# Altium schematic sheet imu.SchDoc
size A
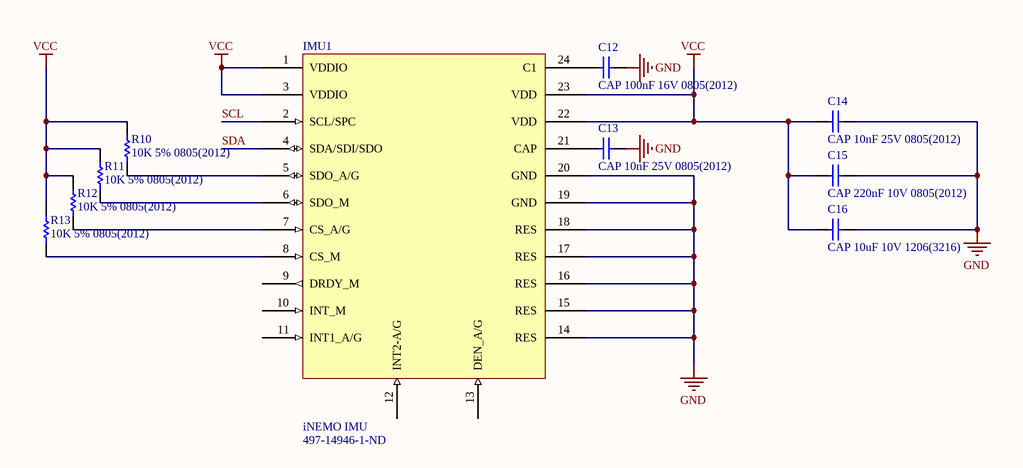
[diagram p0: imu.SchDoc]

## Parts
C12  CAP 100nF 16V 0805(2012)  [CAPC0805(2012)145_M]
C13  CAP 10nF 25V 0805(2012)  [CAPC0805(2012)100_L]
C14  CAP 10nF 25V 0805(2012)  [CAPC0805(2012)100_L]
C15  CAP 220nF 10V 0805(2012)  [CAPC0805(2012)75_N]
C16  CAP 10uF 10V 1206(3216)  [CAPC1206(3216)130_L]
IMU1  iNEMO IMU  Supplier Part Number 1: 497-14946-1-ND  [LGA-24]
R10  10K 5% 0805(2012)  [RESC0805(2012)_L]
R11  10K 5% 0805(2012)  [RESC0805(2012)_L]
R12  10K 5% 0805(2012)  [RESC0805(2012)_L]
R13  10K 5% 0805(2012)  [RESC0805(2012)_L]

## Nets
GND: C12.2 C13.2 C14.2 C15.1 C16.2 IMU1.14(RES) IMU1.15(RES) IMU1.16(RES) IMU1.17(RES) IMU1.18(RES) IMU1.19(GND) IMU1.20(GND)
VCC: C14.1 C15.2 C16.1 IMU1.1(VDDIO) IMU1.3(VDDIO) IMU1.22(VDD) IMU1.23(VDD) R10.2 R11.2 R12.2 R13.2
SCL: IMU1.2(SCL/SPC)
SDA: IMU1.4(SDA/SDI/SDO)
NetC12_1: C12.1 IMU1.24(C1)
NetC13_1: C13.1 IMU1.21(CAP)
NetIMU1_5: IMU1.5(SDO_A/G) R10.1
NetIMU1_6: IMU1.6(SDO_M) R11.1
NetIMU1_7: IMU1.7(CS_A/G) R12.1
NetIMU1_8: IMU1.8(CS_M) R13.1

Not connected (* = marked no-connect by the designer): IMU1 9(DRDY_M) 10(INT_M) 11(INT1_A/G) 12(INT2-A/G) 13(DEN_A/G)

## Library data of the parts
C12 = CMP-1036-04404-1: CAP 100nF 16V ±20% 0805 (2012 Metric) Thickness 1.45mm SMD; Case-Metric: 2012; Case-EIA: 0805; Tolerance: Â±20%; Rated Voltage: 16 V; Max Thickness: 1.45 mm; Value: 100nF; Technology: SMT
C13 C14 = CMP-1036-03826-1: CAP 10nF 25V ±2% 0805 (2012 Metric) Thickness 1mm SMD; Tolerance: Â±2%; Case-EIA: 0805; Case-Metric: 2012; Technology: SMT; Rated Voltage: 25 V; Value: 10nF; Max Thickness: 1 mm
C15 = CMP-1036-04526-1: CAP 220nF 10V ±20% 0805 (2012 Metric) Thickness 0.75mm SMD; Tolerance: Â±20%; Case-EIA: 0805; Case-Metric: 2012; Rated Voltage: 10 V; Max Thickness: 0.75 mm; Technology: SMT; Value: 220nF
C16 = CMP-1037-04970-1: CAP 10uF 10V -20% to +80% 1206 (3216 Metric) Thickness 1.3mm SMD; Case-Metric: 3216; Case-EIA: 1206; Value: 10uF; Rated Voltage: 10 V; Technology: SMT; Max Thickness: 1.3 mm; Tolerance: -20% to +80%
IMU1 = LSM9DS1: Supplier 1: Digikey
R10-R13 = CMP-1013-00098-1: 10K 0.125W 5% 0805 (2012 Metric)  SMD; Case-EIA: 0805; Case-Metric: 2012; Value: 10000.00 Ohm; Power: 0.125 W; Technology: SMT; Tolerance: 5 %